# Altium project Onlab.PrjPcb
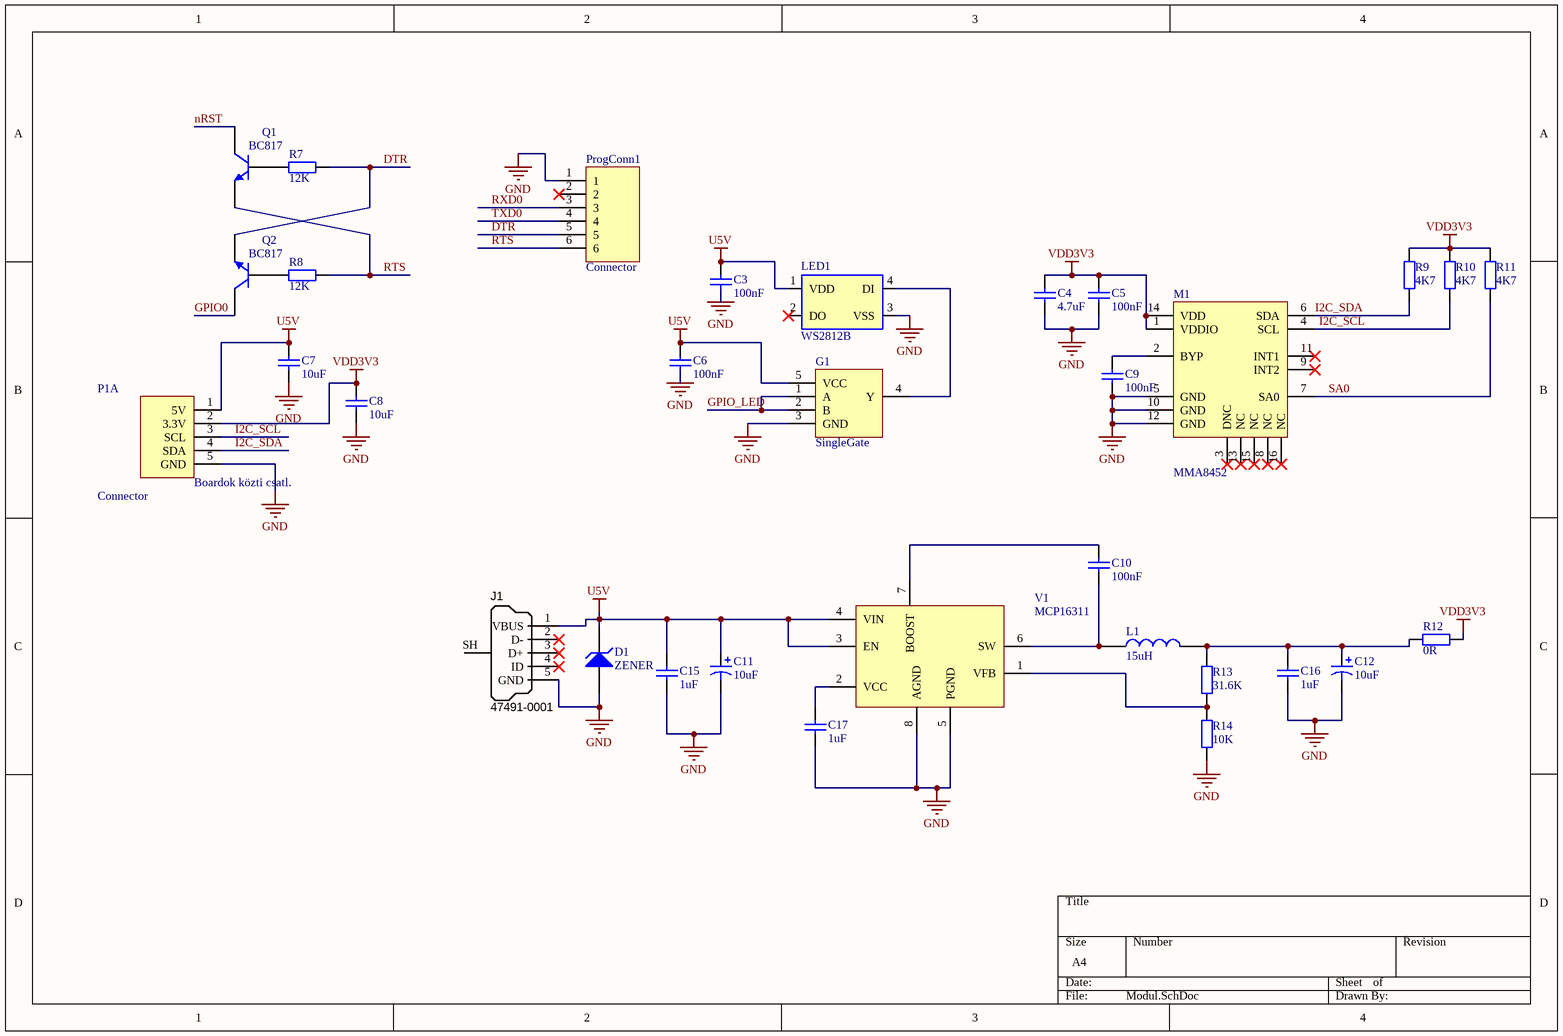
[diagram p0: Modul.SchDoc]
3 sheets, 61 parts. Net scope: global (net labels, ports and power ports of the same name join across sheets).
Board file: ESPModulv2.PcbDoc
Sheets:
  Modul.SchDoc
  02_ESP12_CORE.SchDoc
  Display.SchDoc

## Sheet Modul.SchDoc
size A4

### Parts
C3  100nF  [FP_0805_CAP_085]
C4  4.7uF  [FP_0805_CAP_085]
C5  100nF  [FP_0805_CAP_085]
C6  100nF  [FP_0805_CAP_085]
C7  10uF  [FP_0805_CAP_085]
C8  10uF  [FP_0805_CAP_085]
C9  100nF  [FP_0805_CAP_085]
C10  100nF  [FP_0805_CAP_085]
C11  10uF  [FP_3528]
C12  10uF  [FP_3528]
C15  1uF  [FP_0805_CAP_085]
C16  1uF  [FP_0805_CAP_085]
C17  1uF  [FP_0805_CAP_085]
D1  ZENER  [FP_SMA]
G1  SingleGate  [SOT23-5]
J1  Manufacturer Part Number 1: 47491-0001  [usb_micro]  (hidden comment: USB Micro Type B)
L1  15uH  [FP_IND_MURATA3131]
LED1  WS2812B  [PLCC4-LED]
M1  MMA8452  [QFN50P300X300X100-16N]
P1  Connector  [Csatlakozok]  (part A of 3)
ProgConn1  Connector  [HEADER6b]
Q1  BC817  [FP_SOT23-3]
Q2  BC817  [FP_SOT23-3]
R7  12K  [FP_0805_RES]
R8  12K  [FP_0805_RES]
R9  4K7  [FP_0805_RES]
R10  4K7  [FP_0805_RES]
R11  4K7  [FP_0805_RES]
R12  0R  [FP_0805_RES]
R13  31.6K  [FP_0805_RES]
R14  10K  [FP_0805_RES]
V1  MCP16311  [MSOP8_TSOP65P640X120-8M]

### Nets
GND: C3.1 C4.1 C5.1 C6.1 C7.1 C8.1 C9.1 C11.N C12.N C15.1 C16.1 C17.1 D1.1(A) G1.3(GND) J1.5(GND) LED1.3(VSS) M1.5(GND) M1.10(GND) M1.12(GND) P1.5(GND) ProgConn1.1 R14.1 V1.5(PGND) V1.8(AGND)
U5V: C3.2 C6.2 C7.2 C11.P C15.2 D1.2(K) G1.5(VCC) J1.1(VBUS) LED1.1(VDD) P1.1(5V) V1.3(EN) V1.4(VIN)
VDD3V3: C4.2 C5.2 C8.2 M1.1(VDDIO) M1.14(VDD) P1.2(3.3V) R9.2 R10.2 R11.2 R12.2
DTR: ProgConn1.5 Q2.1(E) R7.2
GPIO0: Q2.3(C)
GPIO_LED: G1.1(A) G1.2(B)
I2C_SCL: M1.4(SCL) P1.3(SCL) R10.1
I2C_SDA: M1.6(SDA) P1.4(SDA) R9.1
nRST: Q1.3(C)
RTS: ProgConn1.6 Q1.1(E) R8.2
RXD0: ProgConn1.3
SA0: M1.7(SA0) R11.1
TXD0: ProgConn1.4
NetC9_2: C9.2 M1.2(BYP)
NetC10_1: C10.1 L1.1 V1.6(SW)
NetC10_2: C10.2 V1.7(BOOST)
NetC12_P: C12.P C16.2 L1.2 R12.1 R13.2
NetC17_2: C17.2 V1.2(VCC)
NetG1_4: G1.4(Y) LED1.4(DI)
NetQ1_2: Q1.2(B) R7.1
NetQ2_2: Q2.2(B) R8.1
NetR13_1: R13.1 R14.2 V1.1(VFB)

Not connected (* = marked no-connect by the designer): J1 2(D-)* 3(D+)* 4(ID)* SH(Shell); LED1 2(DO)*; M1 3(DNC)* 8(NC)* 9(INT2)* 11(INT1)* 13(NC)* 15(NC)* 16(NC)*; ProgConn1 2*

### Notes on the sheet
- (in symbol Csatlakozók, part A) Boardok közti csatl.

### Library data of the parts
C3 C5 C6 C9 C10 = CAP 100nF: Capacitor; Tolerance: +80%/-20%; Voltage: 25V; Reference: 1759167; Name: SMD Multilayer Ceramic Capacitor, 0805; Supplier: Farnell; Value: 100nF
C4 = CAP 47uF: Capacitor; Tolerance: 10%; Voltage: 10V; Reference: 9402160; Name: SMD Multilayer Ceramic Capacitor, 0805; Supplier: Farnell; Value: 4.7uF
C7 C8 = CAP 10uF: Capacitor; Tolerance: 10%; Voltage: 16V; Reference: 2320856; Name: SMD Multilayer Ceramic Capacitor, 0805; Supplier: Farnell; Value: 10uF
C11 C12 = CAP_ELECT: Polarized Capacitor; Value: 10uF
C15-C17 = CAP 1uF: Capacitor; Tolerance: +80%/-20%; Voltage: 25V; Reference: 1828853; Name: SMD Multilayer Ceramic Capacitor, 0805; Supplier: Farnell; Value: 1uF
D1 = ZENER: Zener Diode; U_Z: 24
J1 = USB_Micro_TypeB: Connector SMD USB Micro Type B middle mount; Manufacturer 1: Molex Inc; SCDType: undef; Package / Case: SMD; Supplier 1: Digi-Key; Supplier Part Number 1: WM17142CT-ND
L1 = IND: Inductor; Value: 15uH
LED1 = WS2812B: WorldSemi WS2812B Smart RGB LED; 9.UnitCost: 0.15; 1.Manufacturer: WorldSemi; 2.MfgNo: WS2812B; 3.Supplier: WorldSemi; 4.CatNo: WS2812B
P1 = Csatlakozók: A modul szélső csatlakozói (I2C,táp,programozó,UART)
ProgConn1 = Connector_6pin: 6pin connector
Q1 Q2 = BC817: NPN Transistor; pin to pad: 1>2 2>1; Reference: 1081224; Name: BC817-25,215  Bipolar (BJT) Single Transistor, General Purpose, NPN, 45 V, 100 MHz; Supplier: Farnell
R7 R8 = RES 12K: Resistor; Tolerance: 5%; Power: 125mW; Name: YAGEO (PHYCOMP)  RC0805JR-0712KL  SMD Chip Resistor, Thick Film, 12 kohm; Reference: 9234144; Supplier: Farnell; Value: 12K
R9-R11 = RES 4K7: Resistor; Tolerance: 5%; Power: 125mW; Name: YAGEO (PHYCOMP)  RC0805JR-074K7L  SMD Chip Resistor, Thick Film, 4.7 kohm; Reference: 9234098; Supplier: Farnell; Value: 4K7
R12 = RES: Resistor; Value: 0R
R13 = RES 27K: Resistor; Tolerance: 1%; Power: 125mW; Name: WALSIN  WR08X3162FTL  SMD Chip Resistor, Thick Film, 28 kohm; Reference: 2671010; Supplier: Farnell; Value: 31.6K
R14 = RES 10K: Resistor; Tolerance: 5%; Power: 125mW; Name: YAGEO (PHYCOMP)  RC0805JR-0710KL  SMD Chip Resistor, Thick Film, 10 kohm; Reference: 9234136; Supplier: Farnell; Value: 10K
M1 = MMA8452: Farnell: 1842360

## Sheet 02_ESP12_CORE.SchDoc: ESP-12 CORE
size A4; Date: 20/11/2014; Author: HuangRui <vowstar@gmail.com>; DrawnBy: JiYaping <jyp1817@gmail.com>; Organization: WWW.NODEMCU.COM
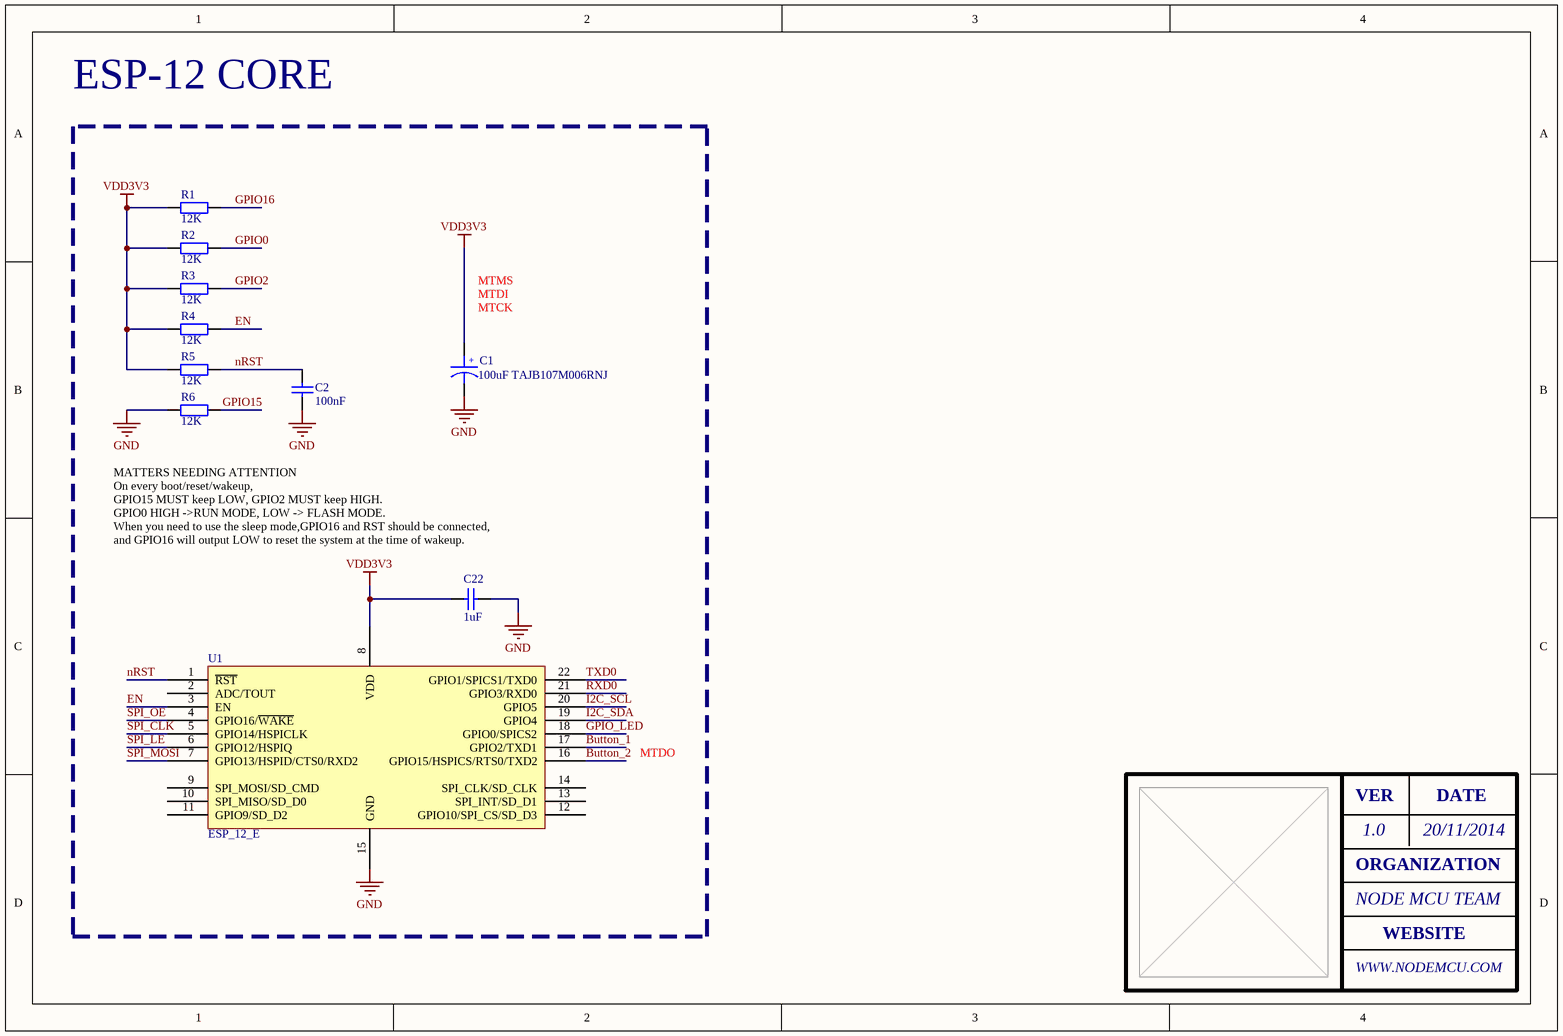
[diagram p1: 02_ESP12_CORE.SchDoc]

### Parts
C1  100uF TAJB107M006RNJ  [FP_Tantal_D]
C2  100nF  [FP_0805_CAP_085]
C22  1uF  [6-0805_M]
R1  12K  [FP_0805_RES]
R2  12K  [FP_0805_RES]
R3  12K  [FP_0805_RES]
R4  12K  [FP_0805_RES]
R5  12K  [FP_0805_RES]
R6  12K  [FP_0805_RES]
U1  ESP_12_E  [ESP_12_E _widepad]

### Nets
GND: C1.2 C2.1 C22.1 R6.1 U1.15(GND)
VDD3V3: C1.1 C22.2 R1.1 R2.1 R3.1 R4.1 R5.1 U1.8(VDD)
Button_1: U1.17(GPIO2/TXD1)
Button_2: U1.16(GPIO15/HSPICS/RTS0/TXD2)
EN: R4.2 U1.3(EN)
GPIO0: R2.2
GPIO2: R3.2
GPIO15: R6.2
GPIO16: R1.2
GPIO_LED: U1.18(GPIO0/SPICS2)
I2C_SCL: U1.20(GPIO5)
I2C_SDA: U1.19(GPIO4)
nRST: C2.2 R5.2 U1.1(~{RST})
RXD0: U1.21(GPIO3/RXD0)
SPI_CLK: U1.5(GPIO14/HSPICLK)
SPI_LE: U1.6(GPIO12/HSPIQ)
SPI_MOSI: U1.7(GPIO13/HSPID/CTS0/RXD2)
SPI_OE: U1.4(GPIO16/~{WAKE})
TXD0: U1.22(GPIO1/SPICS1/TXD0)

Not connected (* = marked no-connect by the designer): U1 2(ADC/TOUT) 9(SPI_MOSI/SD_CMD) 10(SPI_MISO/SD_D0) 11(GPIO9/SD_D2) 12(GPIO10/SPI_CS/SD_D3) 13(SPI_INT/SD_D1) 14(SPI_CLK/SD_CLK)

### Notes on the sheet
- (near C1) MTCK
- MTDI
- MTMS
- MATTERS NEEDING ATTENTION
  On every boot/reset/wakeup,
  GPIO15 MUST keep LOW, GPIO2 MUST keep HIGH.
  GPIO0 HIGH ->RUN MODE, LOW -> FLASH MODE.
  When you need to use the sleep mode,GPIO16 and RST should be connected,
  and GPIO16 will output LOW to reset the system at the time of wakeup.
- MTDO
- VER
- 1.0
- DATE
- ORGANIZATION
- NODE MCU TEAM
- WEBSITE
- (in symbol SMT_C_Tantalum_B) +

### Library data of the parts
C1 = SMT_C_Tantalum_B: Capacitor, SM Tantalum; Body 3.5 x 2.8 mm (LxW typ)
C2 = CAP 100nF: as C3 on sheet Modul; Supplier: Farnell; Value: 100nF
C22 = CAP 1uF: as C15 on sheet Modul; Supplier: Farnell; Value: 1uF
R1-R6 = RES 12K: as R7 on sheet Modul; Supplier: Farnell; Value: 12K
U1 = ESP_12_E: ESP-12 Wi-Fi Module by AI-Thinker; IC: ESP8266-EX; Vendor: Ai-thinker

## Sheet Display.SchDoc
size A4
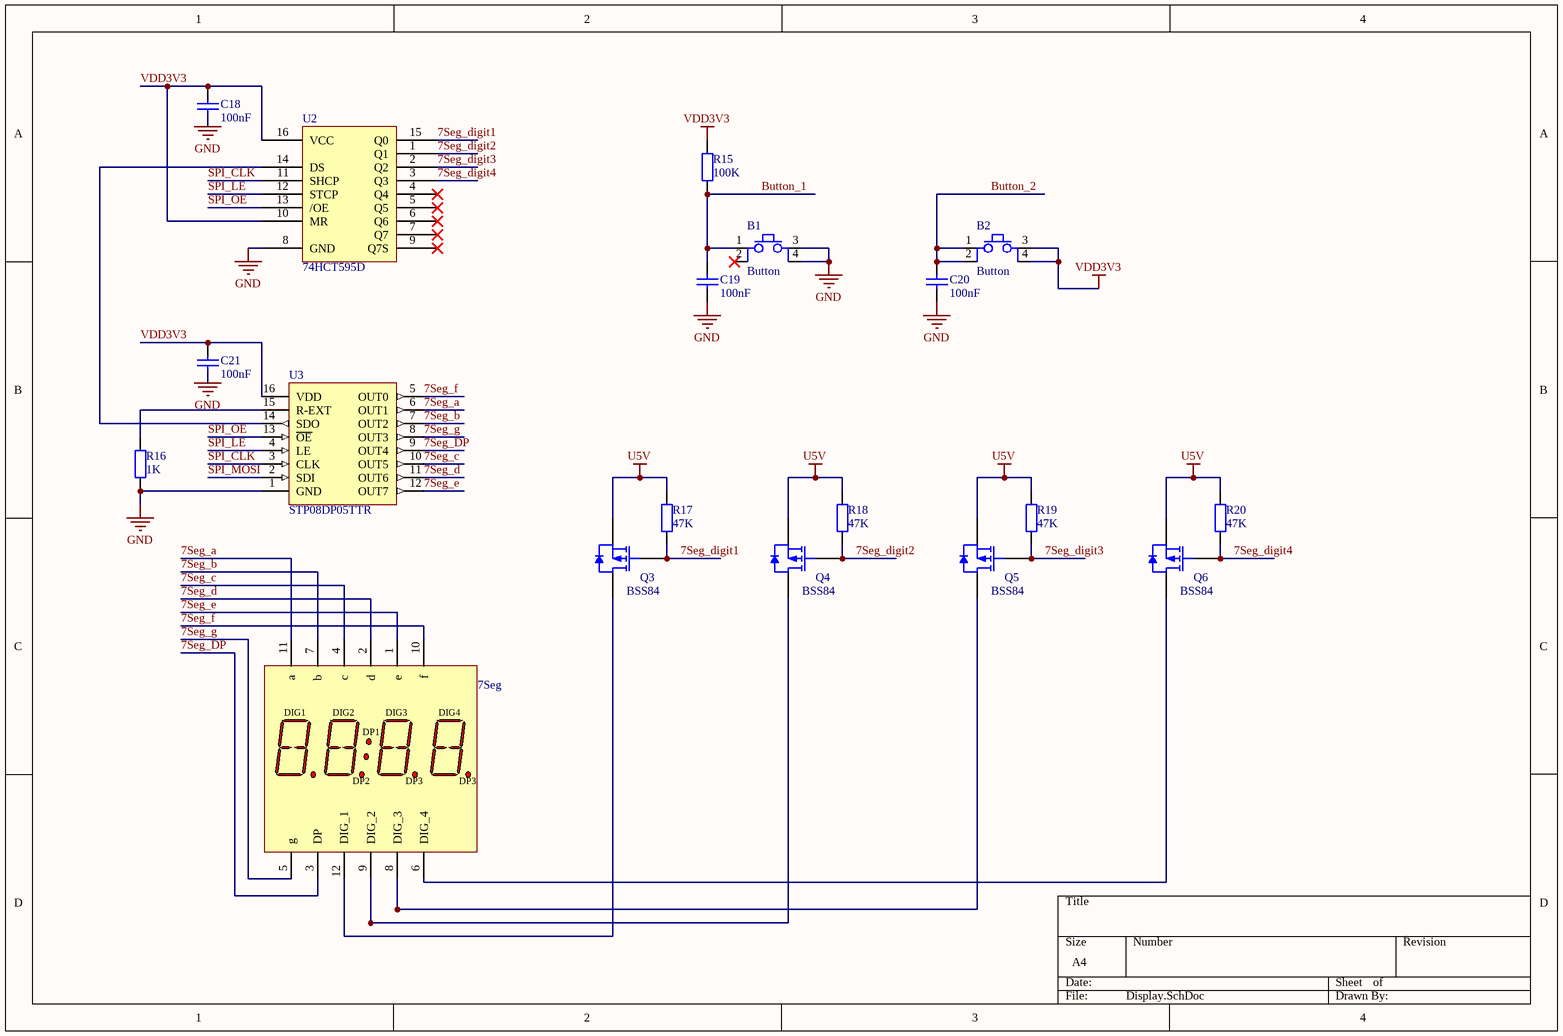
[diagram p2: Display.SchDoc]

### Parts
7Seg  4 digit, 12 pin  [7SEG-12pin]  (value not drawn)
B1  Button  [FP_BTN_SMD]
B2  Button  [FP_BTN_SMD]
C18  100nF  [FP_0805_CAP_085]
C19  100nF  [FP_0805_CAP_085]
C20  100nF  [FP_0805_CAP_085]
C21  100nF  [FP_0805_CAP_085]
Q3  BSS84  [SOT23_N]
Q4  BSS84  [SOT23_N]
Q5  BSS84  [SOT23_N]
Q6  BSS84  [SOT23_N]
R15  100K  [FP_0805_RES]
R16  1K  [FP_0805_RES]
R17  47K  [FP_0805_RES]
R18  47K  [FP_0805_RES]
R19  47K  [FP_0805_RES]
R20  47K  [FP_0805_RES]
U2  74HCT595D  [SOP127P600X175-16M]
U3  STP08DP05TTR  [TSOP65P640X120-16M]

### Nets
GND: B1.3 B1.4 C18.1 C19.1 C20.1 C21.1 R16.1 U2.8(GND) U3.1(GND)
U5V: Q3.2(S) Q4.2(S) Q5.2(S) Q6.2(S) R17.2 R18.2 R19.2 R20.2
VDD3V3: B2.3 B2.4 C18.2 C21.2 R15.2 U2.10(MR) U2.16(VCC) U3.16(VDD)
7Seg_a: 7Seg.11(a) U3.6(OUT1)
7Seg_b: 7Seg.7(b) U3.7(OUT2)
7Seg_c: 7Seg.4(c) U3.10(OUT5)
7Seg_d: 7Seg.2(d) U3.11(OUT6)
7Seg_digit1: Q3.1(G) R17.1 U2.15(Q0)
7Seg_digit2: Q4.1(G) R18.1 U2.1(Q1)
7Seg_digit3: Q5.1(G) R19.1 U2.2(Q2)
7Seg_digit4: Q6.1(G) R20.1 U2.3(Q3)
7Seg_DP: 7Seg.3(DP) U3.9(OUT4)
7Seg_e: 7Seg.1(e) U3.12(OUT7)
7Seg_f: 7Seg.10(f) U3.5(OUT0)
7Seg_g: 7Seg.5(g) U3.8(OUT3)
Button_1: B1.1 C19.2 R15.1
Button_2: B2.1 B2.2 C20.2
SPI_CLK: U2.11(SHCP) U3.3(CLK)
SPI_LE: U2.12(STCP) U3.4(LE)
SPI_MOSI: U3.2(SDI)
SPI_OE: U2.13(/OE) U3.13(~{OE})
Net7Seg_6: 7Seg.6(DIG_4) Q6.3(D)
Net7Seg_8: 7Seg.8(DIG_3) Q5.3(D)
Net7Seg_9: 7Seg.9(DIG_2) Q4.3(D)
Net7Seg_12: 7Seg.12(DIG_1) Q3.3(D)
NetR16_2: R16.2 U3.15(R-EXT)
NetU2_14: U2.14(DS) U3.14(SDO)

Not connected (* = marked no-connect by the designer): B1 2*; U2 4(Q4)* 5(Q5)* 6(Q6)* 7(Q7)* 9(Q7S)*

### Notes on the sheet
- (in symbol 7SEG_4Digit_12pin) DIG1; DIG2; DIG3; DIG4; DP1; DP2; DP3

### Library data of the parts
7Seg = 7SEG_4Digit_12pin
B1 B2 = Button: Push button; Reference: 3801305; Name: FSM4JSMA; Supplier: Farnell
C18-C21 = CAP 100nF: as C3 on sheet Modul; Supplier: Farnell; Value: 100nF
Q3-Q6 = BSS84: P-channel Enhancement Mode Vertical D-MOSFET; Name: FAIRCHILD SEMICONDUCTOR  BSS84  MOSFET Transistor, P Channel, -130 mA, -50 V, 1.2 ohm, -5 V, -1.7 V; Reference: 1094997; PackageReference: SOT23; PackageDescription: 3-Pin SOT-23 Package 0.95 mm Pitch, 2.3 mm Lead Span; Supplier: Farnell
R15 = RES 100K: Resistor; Tolerance: 5%; Power: 125mW; Name: YAGEO (PHYCOMP)  RC0805JR-07100KL  SMD Chip Resistor, Thick Film, 100 kohm; Reference: 9234250; Supplier: Farnell; Value: 100K
R16 = RES 1K: Resistor; Tolerance: 5%; Power: 125mW; Name: YAGEO (PHYCOMP)  RC0805JR-071KL  SMD Chip Resistor, Thick Film, 1 kohm; Reference: 9234004; Supplier: Farnell; Value: 1K
R17-R20 = RES 47K: Resistor; Tolerance: 5%; Power: 125mW; Name: YAGEO (PHYCOMP)  RC0805JR-0747KL  SMD Chip Resistor, Thick Film, 47 kohm; Reference: 9234217; Supplier: Farnell; Value: 47K
U2 = 74HCT595D: Name: NEXPERIA  74HCT595D  Shift Register, HCT Family, 74HCT595, Serial to Parallel, Serial to Serial, 8 Element, 8 bit, SOIC; Reference: 2098004; Supplier: Farnell
U3 = STP08DP05TTR: Low voltage, low current power 8-bit shift register; Reference: 2460707; Name: STMICROELECTRONICS  STP08DP05TTR  Led Driver, 8 Outputs, Constant Current, 3V-5.5V; Supplier: Farnell

## Nets that join several sheets
GND: Modul (24 pins), 02_ESP12_CORE (5 pins), Display (9 pins)
U5V: Modul (12 pins), Display (8 pins)
VDD3V3: Modul (10 pins), 02_ESP12_CORE (8 pins), Display (8 pins)
Button_1: 02_ESP12_CORE (U1.17), Display (B1.1 C19.2 R15.1)
Button_2: 02_ESP12_CORE (U1.16), Display (B2.1 B2.2 C20.2)
GPIO0: Modul (Q2.3), 02_ESP12_CORE (R2.2)
GPIO_LED: Modul (G1.1 G1.2), 02_ESP12_CORE (U1.18)
I2C_SCL: Modul (M1.4 P1.3 R10.1), 02_ESP12_CORE (U1.20)
I2C_SDA: Modul (M1.6 P1.4 R9.1), 02_ESP12_CORE (U1.19)
nRST: Modul (Q1.3), 02_ESP12_CORE (C2.2 R5.2 U1.1)
RXD0: Modul (ProgConn1.3), 02_ESP12_CORE (U1.21)
SPI_CLK: 02_ESP12_CORE (U1.5), Display (U2.11 U3.3)
SPI_LE: 02_ESP12_CORE (U1.6), Display (U2.12 U3.4)
SPI_MOSI: 02_ESP12_CORE (U1.7), Display (U3.2)
SPI_OE: 02_ESP12_CORE (U1.4), Display (U2.13 U3.13)
TXD0: Modul (ProgConn1.4), 02_ESP12_CORE (U1.22)